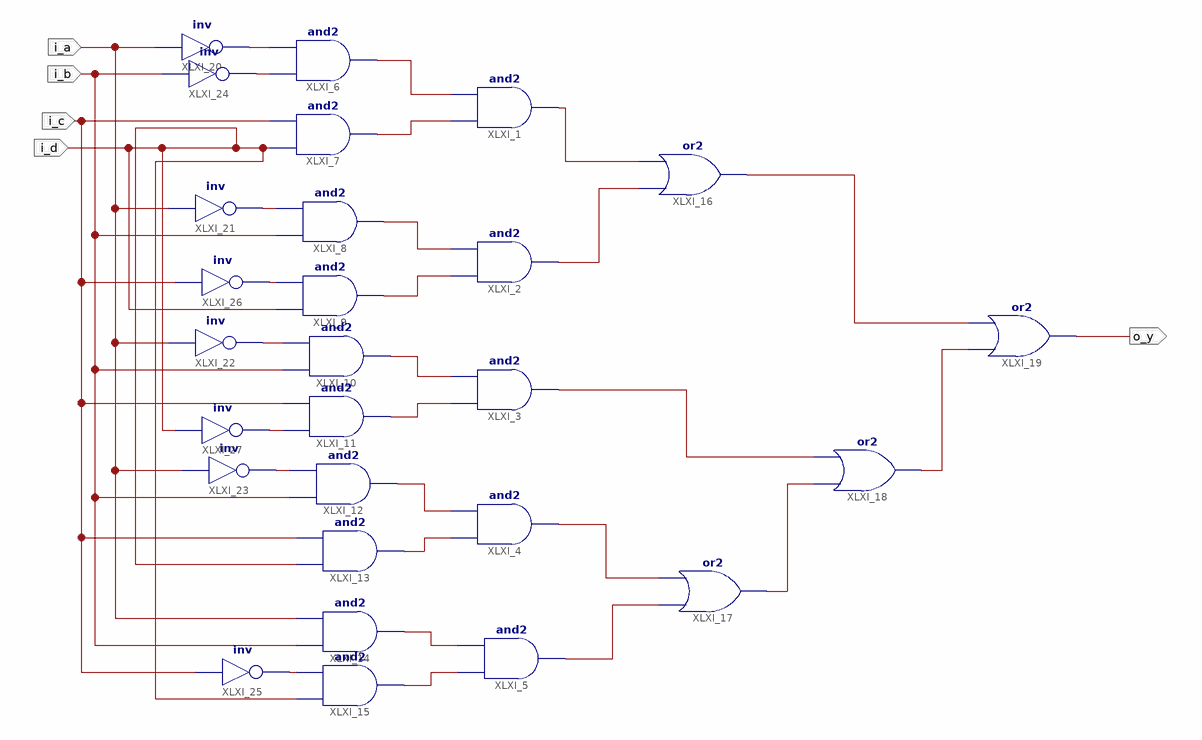
[diagram p0: schematic sheet 1]
// Xilinx ISE schematic Laby4b.sch (spartan3e) as structural Verilog: 27 symbols, 5 ports
module Laby4b (
  input  i_a,
  input  i_b,
  input  i_c,
  input  i_d,
  output o_y
);

  wire XLXN_3, XLXN_4, XLXN_5, XLXN_6, XLXN_7, XLXN_8, XLXN_10, XLXN_11, XLXN_12, XLXN_13, XLXN_14, XLXN_15,
       XLXN_16, XLXN_17, XLXN_18, XLXN_19, XLXN_20, XLXN_21, XLXN_24, XLXN_25, XLXN_26, XLXN_27, XLXN_30,
       XLXN_36, XLXN_37, XLXN_44;

  and XLXI_1 (XLXN_10, XLXN_13, XLXN_12);
  and XLXI_2 (XLXN_11, XLXN_15, XLXN_14);
  and XLXI_3 (XLXN_6, XLXN_17, XLXN_16);
  and XLXI_4 (XLXN_7, XLXN_19, XLXN_18);
  and XLXI_5 (XLXN_8, XLXN_21, XLXN_20);
  and XLXI_6 (XLXN_12, XLXN_30, XLXN_27);
  and XLXI_7 (XLXN_13, i_d, i_c);
  and XLXI_8 (XLXN_14, i_b, XLXN_26);
  and XLXI_9 (XLXN_15, i_d, XLXN_36);
  and XLXI_10 (XLXN_16, i_b, XLXN_25);
  and XLXI_11 (XLXN_17, XLXN_44, i_c);
  and XLXI_12 (XLXN_18, i_b, XLXN_24);
  and XLXI_13 (XLXN_19, i_d, i_c);
  and XLXI_14 (XLXN_20, i_b, i_a);
  and XLXI_15 (XLXN_21, i_d, XLXN_37);
  or XLXI_16 (XLXN_3, XLXN_11, XLXN_10);
  or XLXI_17 (XLXN_5, XLXN_8, XLXN_7);
  or XLXI_18 (XLXN_4, XLXN_5, XLXN_6);
  or XLXI_19 (o_y, XLXN_4, XLXN_3);
  not XLXI_20 (XLXN_27, i_a);
  not XLXI_21 (XLXN_26, i_a);
  not XLXI_22 (XLXN_25, i_a);
  not XLXI_23 (XLXN_24, i_a);
  not XLXI_24 (XLXN_30, i_b);
  not XLXI_25 (XLXN_37, i_c);
  not XLXI_26 (XLXN_36, i_c);
  not XLXI_27 (XLXN_44, i_d);
endmodule
